# Altium schematic sheet 01_POWER.SchDoc
size A; SheetNumber: 1; SheetTotal: 3
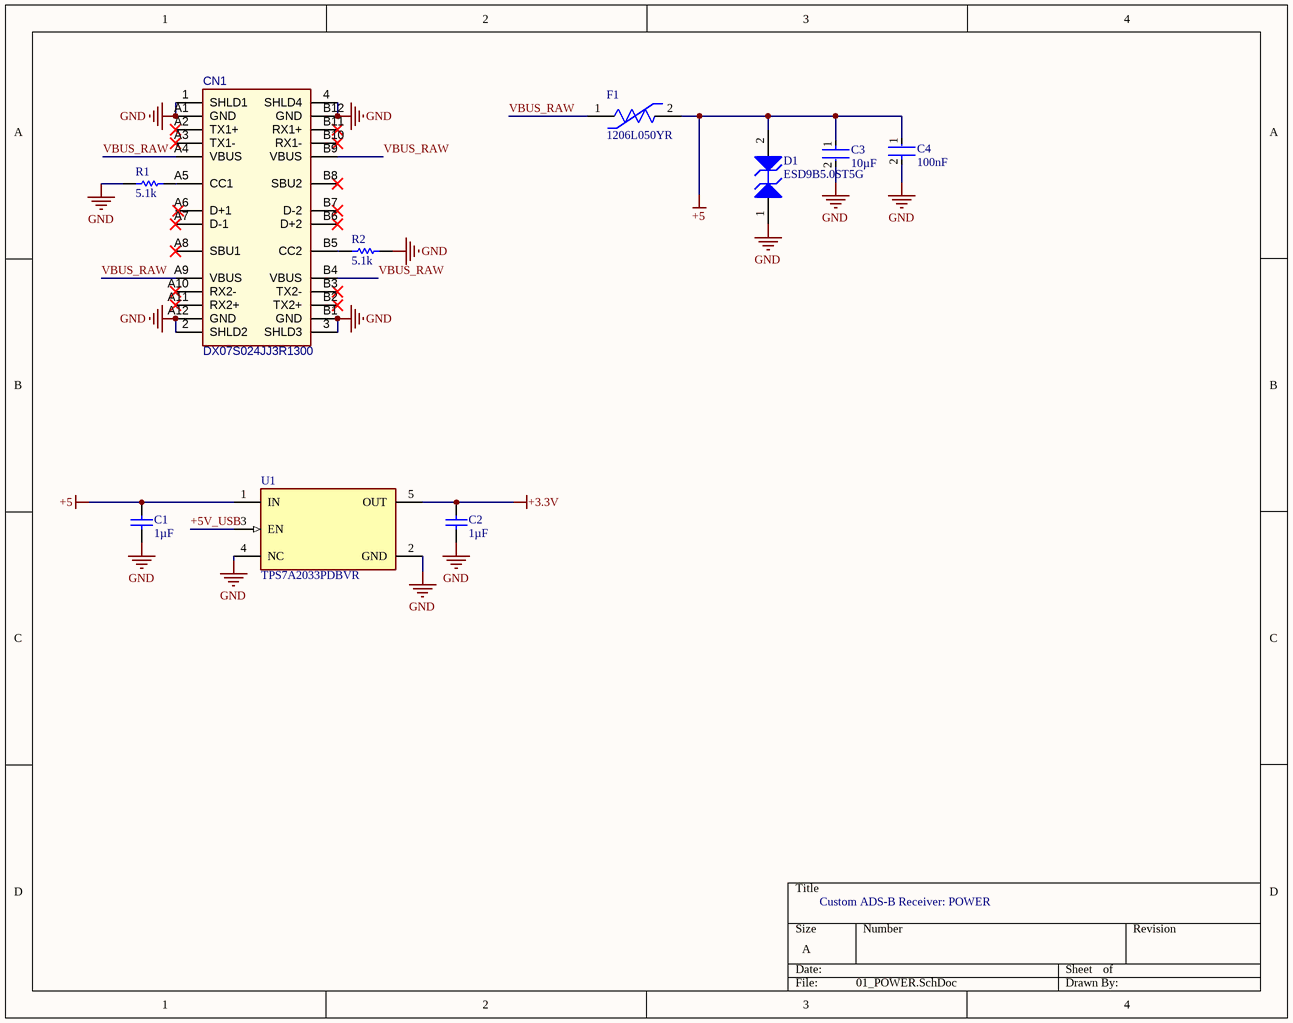
[diagram p0: 01_POWER.SchDoc]

## Parts
C1  value 1µF  [RESC1608X100N]  (hidden comment: GRM188R61A105KA61D)
C2  value 1µF  [RESC1608X100N]  (hidden comment: GRM188R61A105KA61D)
C3  value 10µF  [FP-GRM18-0_15-MFG]  (hidden comment: GRM188R61A106KE69D)
C4  value 100nF  [FP-GRM15-MFG]  (hidden comment: GRM155R71C104KA88D)
CN1  DX07S024JJ3R1300  [JAE-DX07S024JJ3_V]
D1  ESD9B5.0ST5G  [ONSC-SOD-923-2-514AB-01_V]
F1  1206L050YR  [FP-1206L050YR-MFG]
R1  value 5.1k  [RESC1005X40X25NL05T10]  (hidden comment: RC0402FR-075K1L)
R2  value 5.1k  [RESC1005X40X25NL05T10]  (hidden comment: RC0402FR-075K1L)
U1  TPS7A2033PDBVR  [FP-DBV0005A-MFG]

## Nets
+3.3V: C2.2 U1.5(OUT)
+5: C1.2 C3.1 C4.1 D1.2(A2) F1.2 U1.1(IN)
GND: C1.1 C2.1 C3.2 C4.2 CN1.1(SHLD1) CN1.2(SHLD2) CN1.3(SHLD3) CN1.4(SHLD4) CN1.A1(GND) CN1.A12(GND) CN1.B1(GND) CN1.B12(GND) D1.1(A1) R1.1 R2.2 U1.2(GND) U1.4(NC)
+5V_USB: U1.3(EN)
VBUS_RAW: CN1.A4(VBUS) CN1.A9(VBUS) CN1.B4(VBUS) CN1.B9(VBUS) F1.1
NetCN1_A5: CN1.A5(CC1) R1.2
NetCN1_B5: CN1.B5(CC2) R2.1

Not connected (* = marked no-connect by the designer): CN1 A2(TX1+)* A3(TX1-)* A6(D+1) A7(D-1)* A8(SBU1)* A10(RX2-)* A11(RX2+)* B2(TX2+)* B3(TX2-)* B6(D+2)* B7(D-2)* B8(SBU2)* B10(RX1-)* B11(RX1+)*

## Notes on the sheet
- Custom ADS-B Receiver: POWER

## Library data of the parts
C1 C2 = CMP-001-00092-1: 0603 1 uF 10 V ±10% Tolerance X5R SMT Multilayer Ceramic Capacitor; Voltage Rating: 10V; Max Operating Temperature: 85°C; Tolerance: 10%; Case/Package: 0603; Pins: 2; Mounting Technology: Surface Mount; Min Operating Temperature: -55°C
C3 = CMP-001-00094-1: Multilayer Ceramic Capacitor, 10 uF, 10 V, ± 10%, X5R, 0603 [1608 Metric]; Voltage Rating: 10V; Case/Package: 0603; Mounting Technology: Surface Mount; Min Operating Temperature: -55°C; Max Operating Temperature: 85°C; Tolerance: 10%
C4 = CMP-001-00091-1: 16V 100nF X7R ±10% 0402 Multilayer Ceramic Capacitors MLCC - SMD/SMT ROHS; Mounting Technology: Surface Mount; Min Operating Temperature: -55°C; Voltage Rating: 16V; Max Operating Temperature: 125°C; Tolerance: 10%; Case/Package: 0402; Pins: 2
CN1 = CMP-002-00065-3: USB-C Connector, 20 V, 1.25 A, -30 to 80 degC, RoHS, Tape and Reel; Gender: Receptacle; Pins: 28; Connector Type: USB-C
D1 = CMP-004-00036-1: Tvs Diodes & Esd Suppressors; ESD9B5.0ST5G; on Semiconductor; 5 V; 2; 15 V; 5.8 V; Max Surge Current: 1A; Min Operating Temperature: -55°C; Pins: 2; Max Operating Temperature: 150°C; Case/Package: SOD-923-2
F1 = CMP-005-00013-1: PTC Resettable Fuse 0.5A(hold) 1A(trip) 6VDC 100A 0.6W 0.1s 0.15Ohm SMD Solder Pad 1206 T/R; Min Operating Temperature: -40°C; Mounting Technology: Surface Mount; Max Operating Temperature: 85°C; Current Rating: 100A; Case/Package: 1206
R1 R2 = CMP-009-00177-1: 62.5mW Thick Film Resistors 50V ±100ppm/℃ ±1% 5.1kΩ 0402 Chip Resistor - Surface Mount ROHS; Voltage Rating: 50V; Case/Package: 0402; Min Operating Temperature: -55°C; Max Operating Temperature: 155°C; Tolerance: 1%; Pins: 2; Mounting Technology: Surface Mount
U1 = CMP-019-00050-1: 300mA ultra-low-noise low-IQ low-dropout (LDO) linear regulator with high PSRR 5-SOT-23 -40 to 125; Nominal Supply Current: 6.5µA; Dropout Voltage: 145mV; Output Voltage: 3.3V; Max Supply Voltage: 6V; Min Supply Voltage: 1.6V; Output Current: 300mA; Max Operating Temperature: 125°C; Case/Package: SOT-23; Min Operating Temperature: -40°C; Pins: 5